# EAGLE schematic SolarTracker (EAGLE 9.6.2)
Author: Maitreyee Rao, Sanjana Tewathia
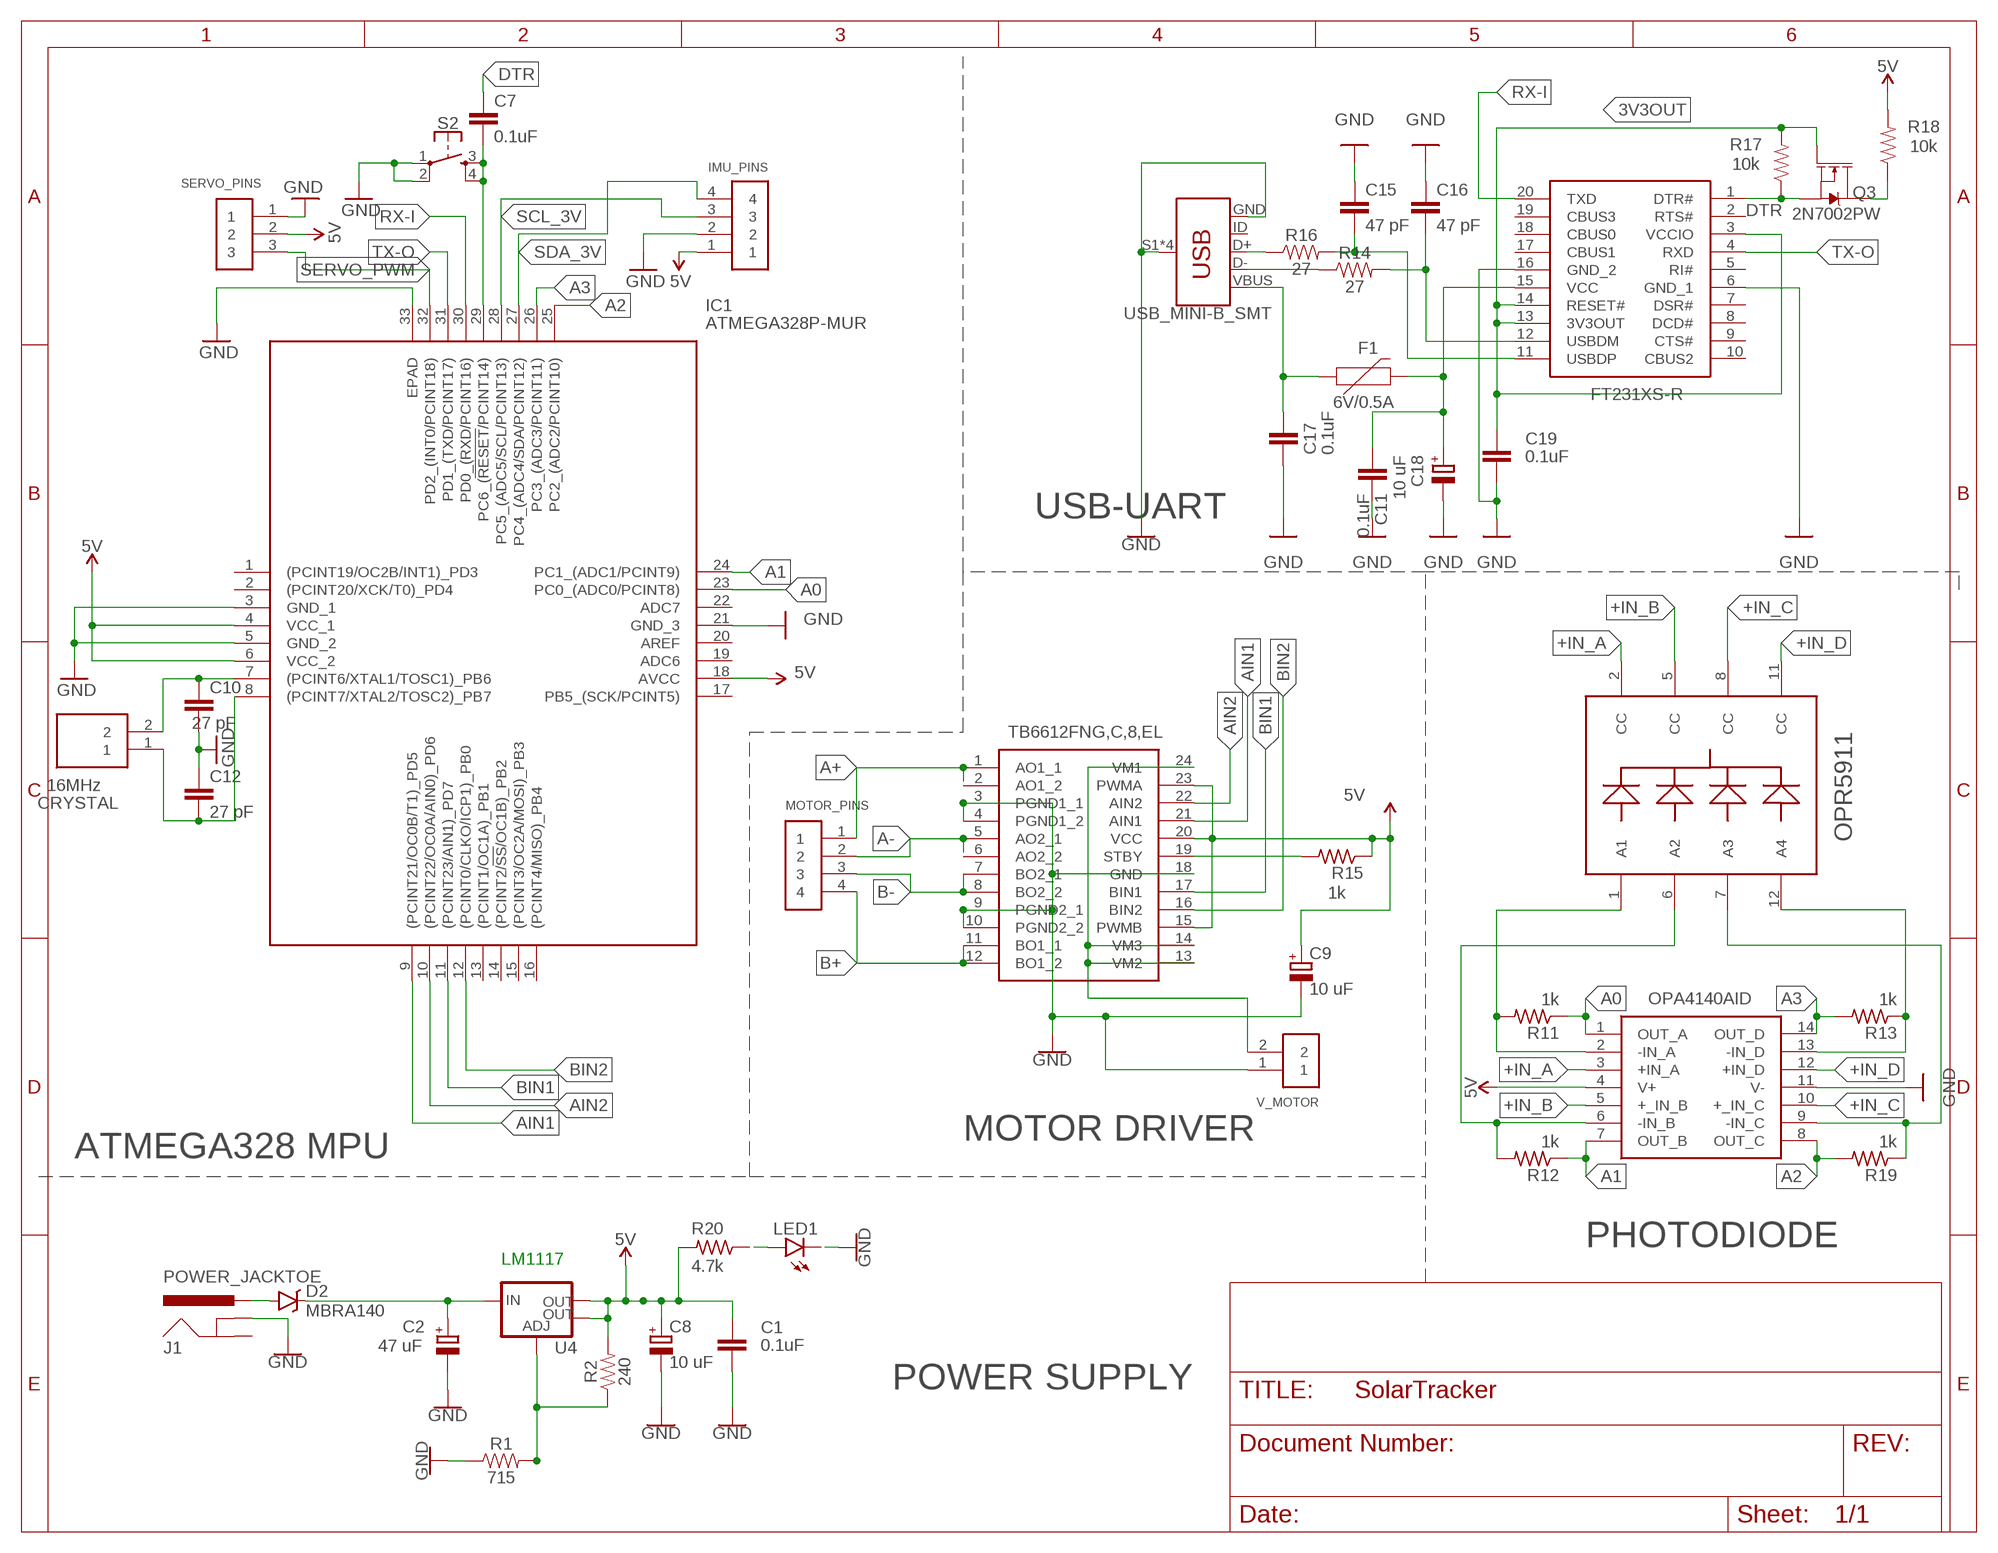
[diagram p0: schematic, sheet 1]

## Parts
C1  0.1uF  C-EUC0603  [C0603]
C2  47 uF  CPOL-EUE2.5-6  [E2,5-6]
C7  0.1uF  C-EUC0603  [C0603]
C8  10 uF  CPOL-EUE2.5-6  [E2,5-6]
C9  10 uF  CPOL-EUE2.5-6  [E2,5-6]
C10  27 pF  C-EU025-025X050  [C025-025X050]
C11  0.1uF  C-EUC0603  [C0603]
C12  27 pF  C-EU025-025X050  [C025-025X050]
C15  47 pF  C-EUC0805  [C0805]
C16  47 pF  C-EUC0805  [C0805]
C17  0.1uF  C-EUC0603  [C0603]
C18  10 uF  CPOL-EUE2.5-6  [E2,5-6]
C19  0.1uF  C-EUC0603  [C0603]
CRYSTAL  16MHz  HC-49_U-S16000000ABJB  [HC49]
D2  MBRA140  [SMA-DIODE]
F1  6V/0.5A  PTC-HALF_AMP  [1206]
IC1  ATMEGA328P-MUR  [QFN50P500X500X100-33N]
IC2  FT231XS-R  [SOP64P599X175-20N]
IC3  OPA4140AID  [SOIC127P600X175-14N]
J1  POWER_JACKTOE  [POWER_JACK_SMD_OVERPASTE_TOE]
J2  USB_MINI-B_SMT  [USB-MINIB]
J4  IMU_PINS  61300411121  [61300411121]
LED1  LED5MM  [LED5MM]
MOTOR_DRIVER  TB6612FNG,C,8,EL  [SOP65P760X160-24N]
MOTOR_PINS  61300411121  [61300411121]
OPR5911  OPR5911  [OPR5911-12]
Q3  2N7002PW  MOSFET-NCH-2N7002PW  [SOT323]
R1  715  715OHM-0603-1/10W-1%  [0603]
R2  240  240OHM-0603-1/10W-1%  [0603]
R11  1k  R-US_0207/10  [0207/10]
R12  1k  R-US_0207/10  [0207/10]
R13  1k  R-US_0207/10  [0207/10]
R14  27  4.7KOHM-0603-1/10W-1%  [0603]
R15  1k  R-US_0207/10  [0207/10]
R16  27  4.7KOHM-0603-1/10W-1%  [0603]
R17  10k  4.7KOHM-0603-1/10W-1%  [0603]
R18  10k  4.7KOHM-0603-1/10W-1%  [0603]
R19  1k  R-US_0207/10  [0207/10]
R20  4.7k  R-US_0207/10  [0207/10]
S2  MOMENTARY-SWITCH-SPST-2-SMD-5.2MM  [TACTILE_SWITCH_SMD_5.2MM]
SERVO_PINS  61300311121  [61300311121]
U4  V_REG_LM1117SOT223  [SOT223]
V_MOTOR  61300211121  [61300211121]

## Nets
3V3OUT: C19.1 IC2.3(VCCIO) IC2.13(3V3OUT) IC2.14(RESET#) Q3.1(G) R17.2
+IN_A: IC3.3(+IN_A) OPR5911.2(CC)
+IN_B: IC3.5(+_IN_B) OPR5911.5(CC)
+IN_C: IC3.10(+_IN_C) OPR5911.8(CC)
+IN_D: IC3.12(+IN_D) OPR5911.11(CC)
A0: IC1.23(PC0_(ADC0/PCINT8)) IC3.1(OUT_A) R11.1
A1: IC1.24(PC1_(ADC1/PCINT9)) IC3.7(OUT_B) R12.1
A2: IC1.25(PC2_(ADC2/PCINT10)) IC3.8(OUT_C) R19.2
A3: IC1.26(PC3_(ADC3/PCINT11)) IC3.14(OUT_D) R13.2
A+: MOTOR_DRIVER.1(AO1_1) MOTOR_DRIVER.2(AO1_2) MOTOR_PINS.1
A-: MOTOR_DRIVER.5(AO2_1) MOTOR_DRIVER.6(AO2_2) MOTOR_PINS.2
AIN1: IC1.9((PCINT21/OC0B/T1)_PD5) MOTOR_DRIVER.21(AIN1)
AIN2: IC1.10((PCINT22/OC0A/AIN0)_PD6) MOTOR_DRIVER.22(AIN2)
B+: MOTOR_DRIVER.11(BO1_1) MOTOR_DRIVER.12(BO1_2) MOTOR_PINS.4
B-: MOTOR_DRIVER.7(BO2_1) MOTOR_DRIVER.8(BO2_2) MOTOR_PINS.3
BIN1: IC1.11((PCINT23/AIN1)_PD7) MOTOR_DRIVER.17(BIN1)
BIN2: IC1.12((PCINT0/CLKO/ICP1)_PB0) MOTOR_DRIVER.16(BIN2)
DTR: C7.1 IC2.1(DTR#) Q3.2(S) R17.1
GND: C1.2 C2.- C8.- C9.- C10.2 C11.1 C12.1 C15.1 C16.1 C17.2 C18.- C19.2 IC1.3(GND_1) IC1.5(GND_2) IC1.21(GND_3) IC1.33(EPAD) IC2.6(GND_1) IC2.16(GND_2) IC3.11(V-) J1.GND(GNDBREAK) J2.GND J2.S1(SHIELD) J2.S2(SHIELD) J2.S3(SHIELD) J2.S4(SHIELD) J4.2 LED1.K(C) MOTOR_DRIVER.3(PGND1_1) MOTOR_DRIVER.4(PGND1_2) MOTOR_DRIVER.9(PGND2_1) MOTOR_DRIVER.10(PGND2_2) MOTOR_DRIVER.18(GND) R1.1 S2.1 S2.2 SERVO_PINS.1 V_MOTOR.1
N$1: C2.+ D2.C U4.3(IN)
N$4: C15.2 IC2.11(USBDP) R16.2
N$5: D2.A J1.VIN0(PWR)
N$6: LED1.A R20.1
N$7: IC3.2(-IN_A) OPR5911.1(A1) R11.2
N$8: R1.2 R2.1 U4.1(ADJ)
N$9: C7.2 IC1.29(PC6_(!RESET!/PCINT14)) S2.3 S2.4
N$10: C16.2 IC2.12(USBDM) R14.2
N$11: IC3.6(-IN_B) OPR5911.6(A2) R12.2
N$12: C10.1 CRYSTAL.2 IC1.7((PCINT6/XTAL1/TOSC1)_PB6)
N$13: IC3.13(-IN_D) OPR5911.12(A4) R13.1
N$14: IC3.9(-IN_C) OPR5911.7(A3) R19.1
N$15: C12.2 CRYSTAL.1 IC1.8((PCINT7/XTAL2/TOSC2)_PB7)
N$16: MOTOR_DRIVER.19(STBY) R15.2
N$21: C17.1 F1.1 J2.VBUS
N$22: J2.D- R14.1
N$23: J2.D+ R16.1
N$24: C11.2 C18.+ F1.2 IC2.15(VCC)
N$26: Q3.3(D) R18.1
RX-I: IC1.30(PD0_(RXD/PCINT16)) IC2.20(TXD)
SCL_3V: IC1.28(PC5_(ADC5/SCL/PCINT13)) J4.3
SDA_3V: IC1.27(PC4_(ADC4/SDA/PCINT12)) J4.4
SERVO_PWM: IC1.32(PD2_(INT0/PCINT18)) SERVO_PINS.3
TX-O: IC1.31(PD1_(TXD/PCINT17)) IC2.4(RXD)
VIN: C1.1 C8.+ C9.+ IC1.4(VCC_1) IC1.6(VCC_2) IC1.18(AVCC) IC3.4(V+) J4.1 MOTOR_DRIVER.15(PWMB) MOTOR_DRIVER.20(VCC) MOTOR_DRIVER.23(PWMA) R2.2 R15.1 R18.2 R20.2 SERVO_PINS.2 U4.2(OUT) U4.4(OUT) ; supply symbol labelled 5V
VMOTOR: MOTOR_DRIVER.13(VM2) MOTOR_DRIVER.14(VM3) MOTOR_DRIVER.24(VM1) V_MOTOR.2
Unconnected: IC1.1((PCINT19/OC2B/INT1)_PD3) IC1.2((PCINT20/XCK/T0)_PD4) IC1.13((PCINT1/OC1A)_PB1) IC1.14((PCINT2/!SS!/OC1B)_PB2) IC1.15((PCINT3/OC2A/MOSI)_PB3) IC1.16((PCINT4/MISO)_PB4) IC1.17(PB5_(SCK/PCINT5)) IC1.19(ADC6) IC1.20(AREF) IC1.22(ADC7) IC2.2(RTS#) IC2.5(RI#) IC2.7(DSR#) IC2.8(DCD#) IC2.9(CTS#) IC2.10(CBUS2) IC2.17(CBUS1) IC2.18(CBUS0) IC2.19(CBUS3) J1.P$4(GND) J2.ID

## Notes on the sheet
- USB-UART
- MOTOR DRIVER
- ATMEGA328 MPU
- PHOTODIODE
- LM1117
- POWER SUPPLY

## Library data of the parts
C1 C7 C10-C12 C15-C17 C19 = rcl:C-EU: CAPACITOR, European symbol; SPICEPREFIX: C
C2 C8 C9 C18 = rcl:CPOL-EU: POLARIZED CAPACITOR, European symbol; SPICEPREFIX: C
CRYSTAL = HC-49_U-S16000000ABJB:HC-49_U-S16000000ABJB: Crystals 16MHz 18pF HC49S THROUGH HOLE Source: Datasheet <http://cfd.citizen.co.jp/english/prod-tech/product/pdf/datasheet_AT/HC-49_U-S_E.pdf>; DESCRIPTION: Crystals 16MHz 18pF HC49S THROUGH HOLE; HEIGHT: mm; MANUFACTURER_NAME: Citizen Finetech Miyota; MANUFACTURER_PART_NUMBER: HC-49/U-S16000000ABJB; MOUSER_PART_NUMBER: 695-HC49US16.0ABJB; MOUSER_PRICE-STOCK: https://www.mouser.co.uk/ProductDetail/Citizen-FineDevice/HC-49-U-S16000000ABJB?qs=byeeYqUIh0M5kN9OYTo1Hw%3D%3D
D2 = MBRA140:MBRA140: 40V, 1A Schottky rectifier SMA/DO-214AC package DIO-08053 Check prices <https://pricing.snapeda.com/parts/MBRA140/ON%20Semiconductor/view-part?ref=eda>; AVAILABILITY: Bad; DESCRIPTION: Diode Schottky 40V 1A Surface Mount SMA; MF: ON Semiconductor; MP: MBRA140; PACKAGE: DO-214 ON Semiconductor; PRICE: None
F1 = SparkFun-Fuses:PTC: Resettable Fuse PTC Resettable Fuse. Really a resistor with a postive temperature coefficient who's resistance increases dramatically with an increase in temperature. When heated by the power passing through the resistance rises causing the current to be limited, protecting the circuit. When a PTC cools back down it resumes conducting letting the circuit turn back on.; PROD_ID: RES-08585
IC1 = ATMEGA328P-MUR:ATMEGA328P-MUR: MCU 8-bit ATmega AVR RISC 32KB Flash 2.5V/3.3V/5V 32-Pin VQFN EP T/R Source: Datasheet <http://ww1.microchip.com/downloads/en/DeviceDoc/Atmel-42735-8-bit-AVR-Microcontroller-ATmega328-328P_Summary.pdf>; ARROW_PART_NUMBER: ATMEGA328P-MUR; ARROW_PRICE-STOCK: https://www.arrow.com/en/products/atmega328p-mur/microchip-technology; DESCRIPTION: MCU 8-bit ATmega AVR RISC 32KB Flash 2.5V/3.3V/5V 32-Pin VQFN EP T/R; HEIGHT: 1mm; MANUFACTURER_NAME: Microchip; MANUFACTURER_PART_NUMBER: ATMEGA328P-MUR; MOUSER_PART_NUMBER: 556-ATMEGA328P-MUR; MOUSER_PRICE-STOCK: https://www.mouser.co.uk/ProductDetail/Microchip-Technology-Atmel/ATMEGA328P-MUR?qs=6Dg1WZIWLC7u6Xm9ddn7Uw%3D%3D
IC2 = FT231XS-R:FT231XS-R: USB SSOP-20 RoHS Source: Datasheet <https://datasheet.lcsc.com/szlcsc/Future-Designs-FT231XS-R_C132160.pdf>; DESCRIPTION: USB SSOP-20 RoHS; HEIGHT: 1.753mm; MANUFACTURER_NAME: Future Designs; MANUFACTURER_PART_NUMBER: FT231XS-R
IC3 = OPA4140AID:OPA4140AID: TI,OPA4140AID,IC,Op Amp Texas Instruments OPA4140AID, Quad JFET Op Amp, 11MHz Rail-Rail, 4.5 36 V, 14-Pin SOIC Source: Datasheet <http://docs-emea.rs-online.com/webdocs/12f9/0900766b812f9329.pdf>; ARROW_PART_NUMBER: OPA4140AID; ARROW_PRICE-STOCK: https://www.arrow.com/en/products/opa4140aid/texas-instruments; DESCRIPTION: TI,OPA4140AID,IC,Op Amp Texas Instruments OPA4140AID, Quad JFET Op Amp, 11MHz Rail-Rail, 4.5 36 V, 14-Pin SOIC; HEIGHT: 1.75mm; MANUFACTURER_NAME: Texas Instruments; MANUFACTURER_PART_NUMBER: OPA4140AID; MOUSER_PART_NUMBER: 595-OPA4140AID; MOUSER_PRICE-STOCK: https://www.mouser.com/Search/Refine.aspx?Keyword=595-OPA4140AID
J1 = SparkFun-Connectors:POWER_JACK: Power Jack Connector This is the standard 5.5mm barrel jack for power. The PTH is the most common, proven, reliable, footprint. The Slot footprint only works if the mill layer is transmitted to the PCB fab house so be warned. Here are the connectors we sell at SparkFun: DC Barrel Power Jack/Connector <https://www.sparkfun.com/products/119> (PRT-00119) DC Barrel Power Jack/Connector (SMD) <https://www.sparkfun.com/products/12748> (PRT-12748) DC Barrel Jack Adapter - Breadboard Compatible <https://www.sparkfun.com/products/10811> (PRT-10811) It is used on this SparkFun product (and many, many others): SparkFun RedBoard - Programmed with Arduino <https://www.sparkfun.com/products/12757> (DEV-12757) Also, if you need a mating power supply or connector, please check these out: Wall Adapter Power Supply - 9VDC 650mA <https://www.sparkfun.com/products/298> (TOL-00298) DC Barrel Jack Adapter - Male <https://www.sparkfun.com/products/10287> (PRT-10287); PROD_ID: CONN-08106; SF_ID: PRT-12748
J2 = SparkFun-Connectors:USB_MINI-B: USB type Mini-B Connector Breaks out 5th pin, and includes shield pins if needed. SparkFun Products: SparkFun FTDI Basic Breakout <https://www.sparkfun.com/products/9716> SparkFun XBee Explorer USB <https://www.sparkfun.com/products/11812> SparkFun Redboard <https://www.sparkfun.com/products/12757>; PROD_ID: CONN-08193; SF_ID: PRT-00587
J4 MOTOR_PINS = Headers:61300411121: CONN HEADER VERT 4POS 2.54MM Manufacturer's datasheet <https://katalog.we-online.de/em/datasheet/6130xx11121.pdf>; CREATED_BY: PCBLayout.com; DIGI_KEY_PART_NUMBER: 732-5317-ND; MANUFACTURER: Wurth Electronics Inc.; MPN: 61300411121
LED1 = led:LED: LED OSRAM: - CHIPLED LG R971, LG N971, LY N971, LG Q971, LY Q971, LO R971, LY R971 LH N974, LH R974 LS Q976, LO Q976, LY Q976 LO Q996 - Hyper CHIPLED LW Q18S LB Q993, LB Q99A, LB R99A - SideLED LS A670, LO A670, LY A670, LG A670, LP A670 LB A673, LV A673, LT A673, LW A673 LH A674 LY A675 LS A676, LA A676, LO A676, LY A676, LW A676 LS A679, LY A679, LG A679 - Hyper Micro SIDELED® LS Y876, LA Y876, LO Y876, LY Y876 LT Y87S - SmartLED LW L88C, LW L88S LB L89C, LB L89S, LG L890 LS L89K, LO L89K, LY L89K LS L896, LA L896, LO L896, LY L896 - TOPLED LS T670, LO T670, LY T670, LG T670, LP T670 LSG T670, LSP T670, LSY T670, LOP T670, LYG T670 LG T671, LOG T671, LSG T671 LB T673, LV T673, LT T673, LW T673 LH T674 LS T676, LA T676, LO T676, LY T676, LB T676, LH T676, LSB T676, LW T676 LB T67C, LV T67C, LT T67C, LS T67K, LO T67K, LY T67K, LW E67C LS E67B, LA E67B, LO E67B, LY E67B, LB E67C, LV E67C, LT E67C LW T67C LS T679, LY T679, LG T679 LS T770, LO T770, LY T770, LG T770, LP T770 LB T773, LV T773, LT T773, LW T773 LH T774 LS E675, LA E675, LY E675, LS T675 LS T776, LA T776, LO T776, LY T776, LB T776 LHGB T686 LT T68C, LB T68C - Hyper Mini TOPLED® LB M676 - Mini TOPLED Santana® LG M470 LS M47K, LO M47K, LY M47K Source: http://www.osram.convergy.de LUXEON: - LUMILED® LXK2-PW12-R00, LXK2-PW12-S00, LXK2-PW14-U00, LXK2-PW14-V00 LXK2-PM12-R00, LXK2-PM12-S00, LXK2-PM14-U00 LXK2-PE12-Q00, LXK2-PE12-R00, LXK2-PE12-S00, LXK2-PE14-T00, LXK2-PE14-U00 LXK2-PB12-K00, LXK2-PB12-L00, LXK2-PB12-M00, LXK2-PB14-N00, LXK2-PB14-P00, LXK2-PB14-Q00 LXK2-PR12-L00, LXK2-PR12-M00, LXK2-PR14-Q00, LXK2-PR14-R00 LXK2-PD12-Q00, LXK2-PD12-R00, LXK2-PD12-S00 LXK2-PH12-R00, LXK2-PH12-S00 LXK2-PL12-P00, LXK2-PL12-Q00, LXK2-PL12-R00 Source: www.luxeon.com KINGBRIGHT: KA-3528ASYC Source: www.kingbright.com
MOTOR_DRIVER = TB6612FNG_C_8_EL:TB6612FNG,C,8,EL: otor / Motion / Ignition Controllers & Drivers Brush Motor Driver IC Source: Datasheet <http://toshiba.semicon-storage.com/info/docget.jsp?did=10660&prodName=TB6612FNG>; ARROW_PART_NUMBER: TB6612FNG,C,8,EL; ARROW_PRICE-STOCK: https://www.arrow.com/en/products/tb6612fngc8el/toshiba; DESCRIPTION: otor / Motion / Ignition Controllers & Drivers Brush Motor Driver IC; HEIGHT: 1.6mm; MANUFACTURER_NAME: Toshiba; MANUFACTURER_PART_NUMBER: TB6612FNG,C,8,EL; MOUSER_PART_NUMBER: 757-TB6612FNGC8EL; MOUSER_PRICE-STOCK: https://www.mouser.co.uk/ProductDetail/Toshiba/TB6612FNGC8EL?qs=rsevcuukUAy2UalRuv4E%2FQ%3D%3D
OPR5911 = OPR5911:OPR5911
Q3 = SparkFun-DiscreteSemi:MOSFET-NCH: N-channel MOSFETs Voltage controlled devices that allow control of high current outputs.; PROD_ID: TRANS-11151; VALUE: 310mA/60V/1.6Ω
R1 = SparkFun-Resistors:715OHM: 715Ω resistor A resistor is a passive two-terminal electrical component that implements electrical resistance as a circuit element. Resistors act to reduce current flow, and, at the same time, act to lower voltage levels within circuits. - Wikipedia; PROD_ID: RES-07850
R2 = SparkFun-Resistors:240OHM: 240Ω resistor A resistor is a passive two-terminal electrical component that implements electrical resistance as a circuit element. Resistors act to reduce current flow, and, at the same time, act to lower voltage levels within circuits. - Wikipedia; PROD_ID: RES-07849
R11-R13 R15 R19 R20 = adafruit:R-US_: RESISTOR, American symbol
R14 R16-R18 = SparkFun-Resistors:4.7KOHM: 4.7kΩ resistor A resistor is a passive two-terminal electrical component that implements electrical resistance as a circuit element. Resistors act to reduce current flow, and, at the same time, act to lower voltage levels within circuits. - Wikipedia; PROD_ID: RES-07857; VALUE: 4.7k
S2 = SparkFun-Switches:MOMENTARY-SWITCH-SPST-2: Momentary Switch (Pushbutton) - SPST - Two Circuits Normally-open (NO) SPST momentary switches (buttons, pushbuttons). Schematic symbol includes two switch circuits. Variants SMD-4.6MMX2.8MM - 4.60mm x 2.80mm Tactile Momentary Button Switch - Used on SparkFun SAMD21 Mini Breakout <https://www.sparkfun.com/products/13664> SMD-5.2MM - Mini Pushbutton Switch - SMD <https://www.sparkfun.com/products/8720> - Used on Arduino Pro Mini <https://www.sparkfun.com/products/11114>; PROD_ID: SWCH-08247; SF_SKU: COM-08720
SERVO_PINS = Headers:61300311121: CONN HEADER VERT 3POS 2.54MM Manufacturer's datasheet <https://katalog.we-online.de/em/datasheet/6130xx11121.pdf>; CREATED_BY: PCBLayout.com; DIGI_KEY_PART_NUMBER: 732-5316-ND; MANUFACTURER: Wurth Electronics Inc.; MPN: 61300311121
U4 = SparkFun-IC-Power:V_REG_LM1117: Voltage Regulator LM1117 Standard adjustable voltage regulator but in SMD form. Spark Fun Electronics SKU : COM-00595; PROD_ID: VREG-08170
V_MOTOR = Headers:61300211121: CONN HEADER VERT 2POS 2.54MM Manufacturer's datasheet <https://katalog.we-online.de/em/datasheet/6130xx11121.pdf>; CREATED_BY: PCBLayout.com; DIGI_KEY_PART_NUMBER: 732-5315-ND; MANUFACTURER: Wurth Electronics Inc.; MPN: 61300211121